# EAGLE schematic psu (EAGLE 7.2.0)
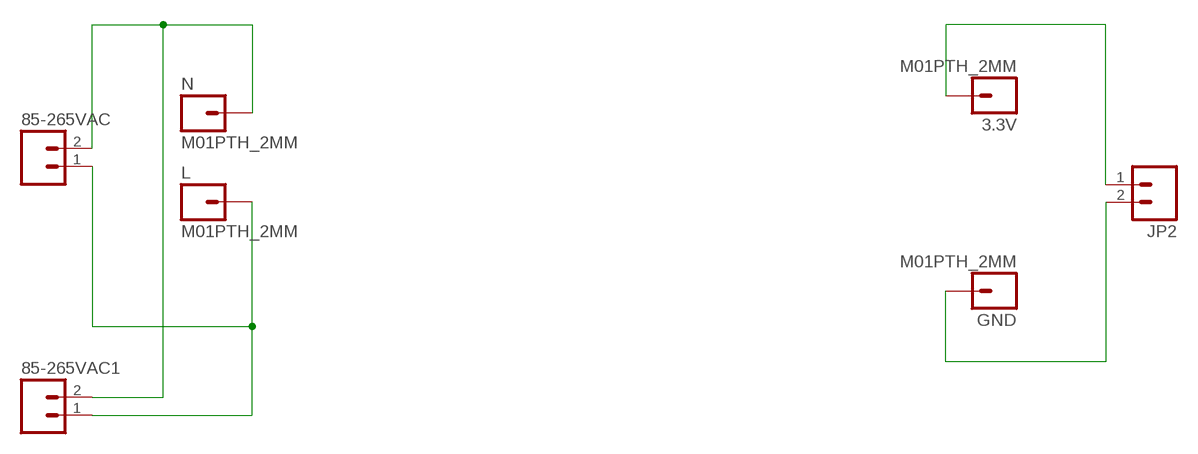
[diagram p0: schematic, sheet 1]

## Parts
3.3V  M01PTH_2MM  [1X01_2MM]
85-265VAC  M02PTH3_5MM  [1X02_LONGPADS]
85-265VAC1  M02PTH3_5MM  [1X02_LONGPADS]
GND  M01PTH_2MM  [1X01_2MM]
JP2  M02PTH3_5MM  [1X02_LONGPADS]
L  M01PTH_2MM  [1X01_2MM]
N  M01PTH_2MM  [1X01_2MM]

## Nets
N$1: 85-265VAC1.1 85-265VAC.1 L.1
N$2: 85-265VAC1.2 85-265VAC.2 N.1
N$3: 3.3V.1 JP2.1
N$4: GND.1 JP2.2

## Library data of the parts
3.3V GND L N = SparkFun (old):M01: Header 1 Standard 1-pin 0.1" header. Use with straight break away headers (SKU : PRT-00116), right angle break away headers (PRT-00553), swiss pins (PRT-00743), machine pins (PRT-00117), and female headers (PRT-00115).
85-265VAC 85-265VAC1 JP2 = SparkFun (old):M02: Header 2 Standard 2-pin 5 mm header